# EasyEDA schematic SCH_keyboard_ProMicro_2025-01-13.json

## Sheets
1 Sheet_1: TITLE: Sheet_1; REV: 1.0; Date: 2024-12-30; Sheet: 1/1; Drawn By: polpoillopi; Company: Your Company
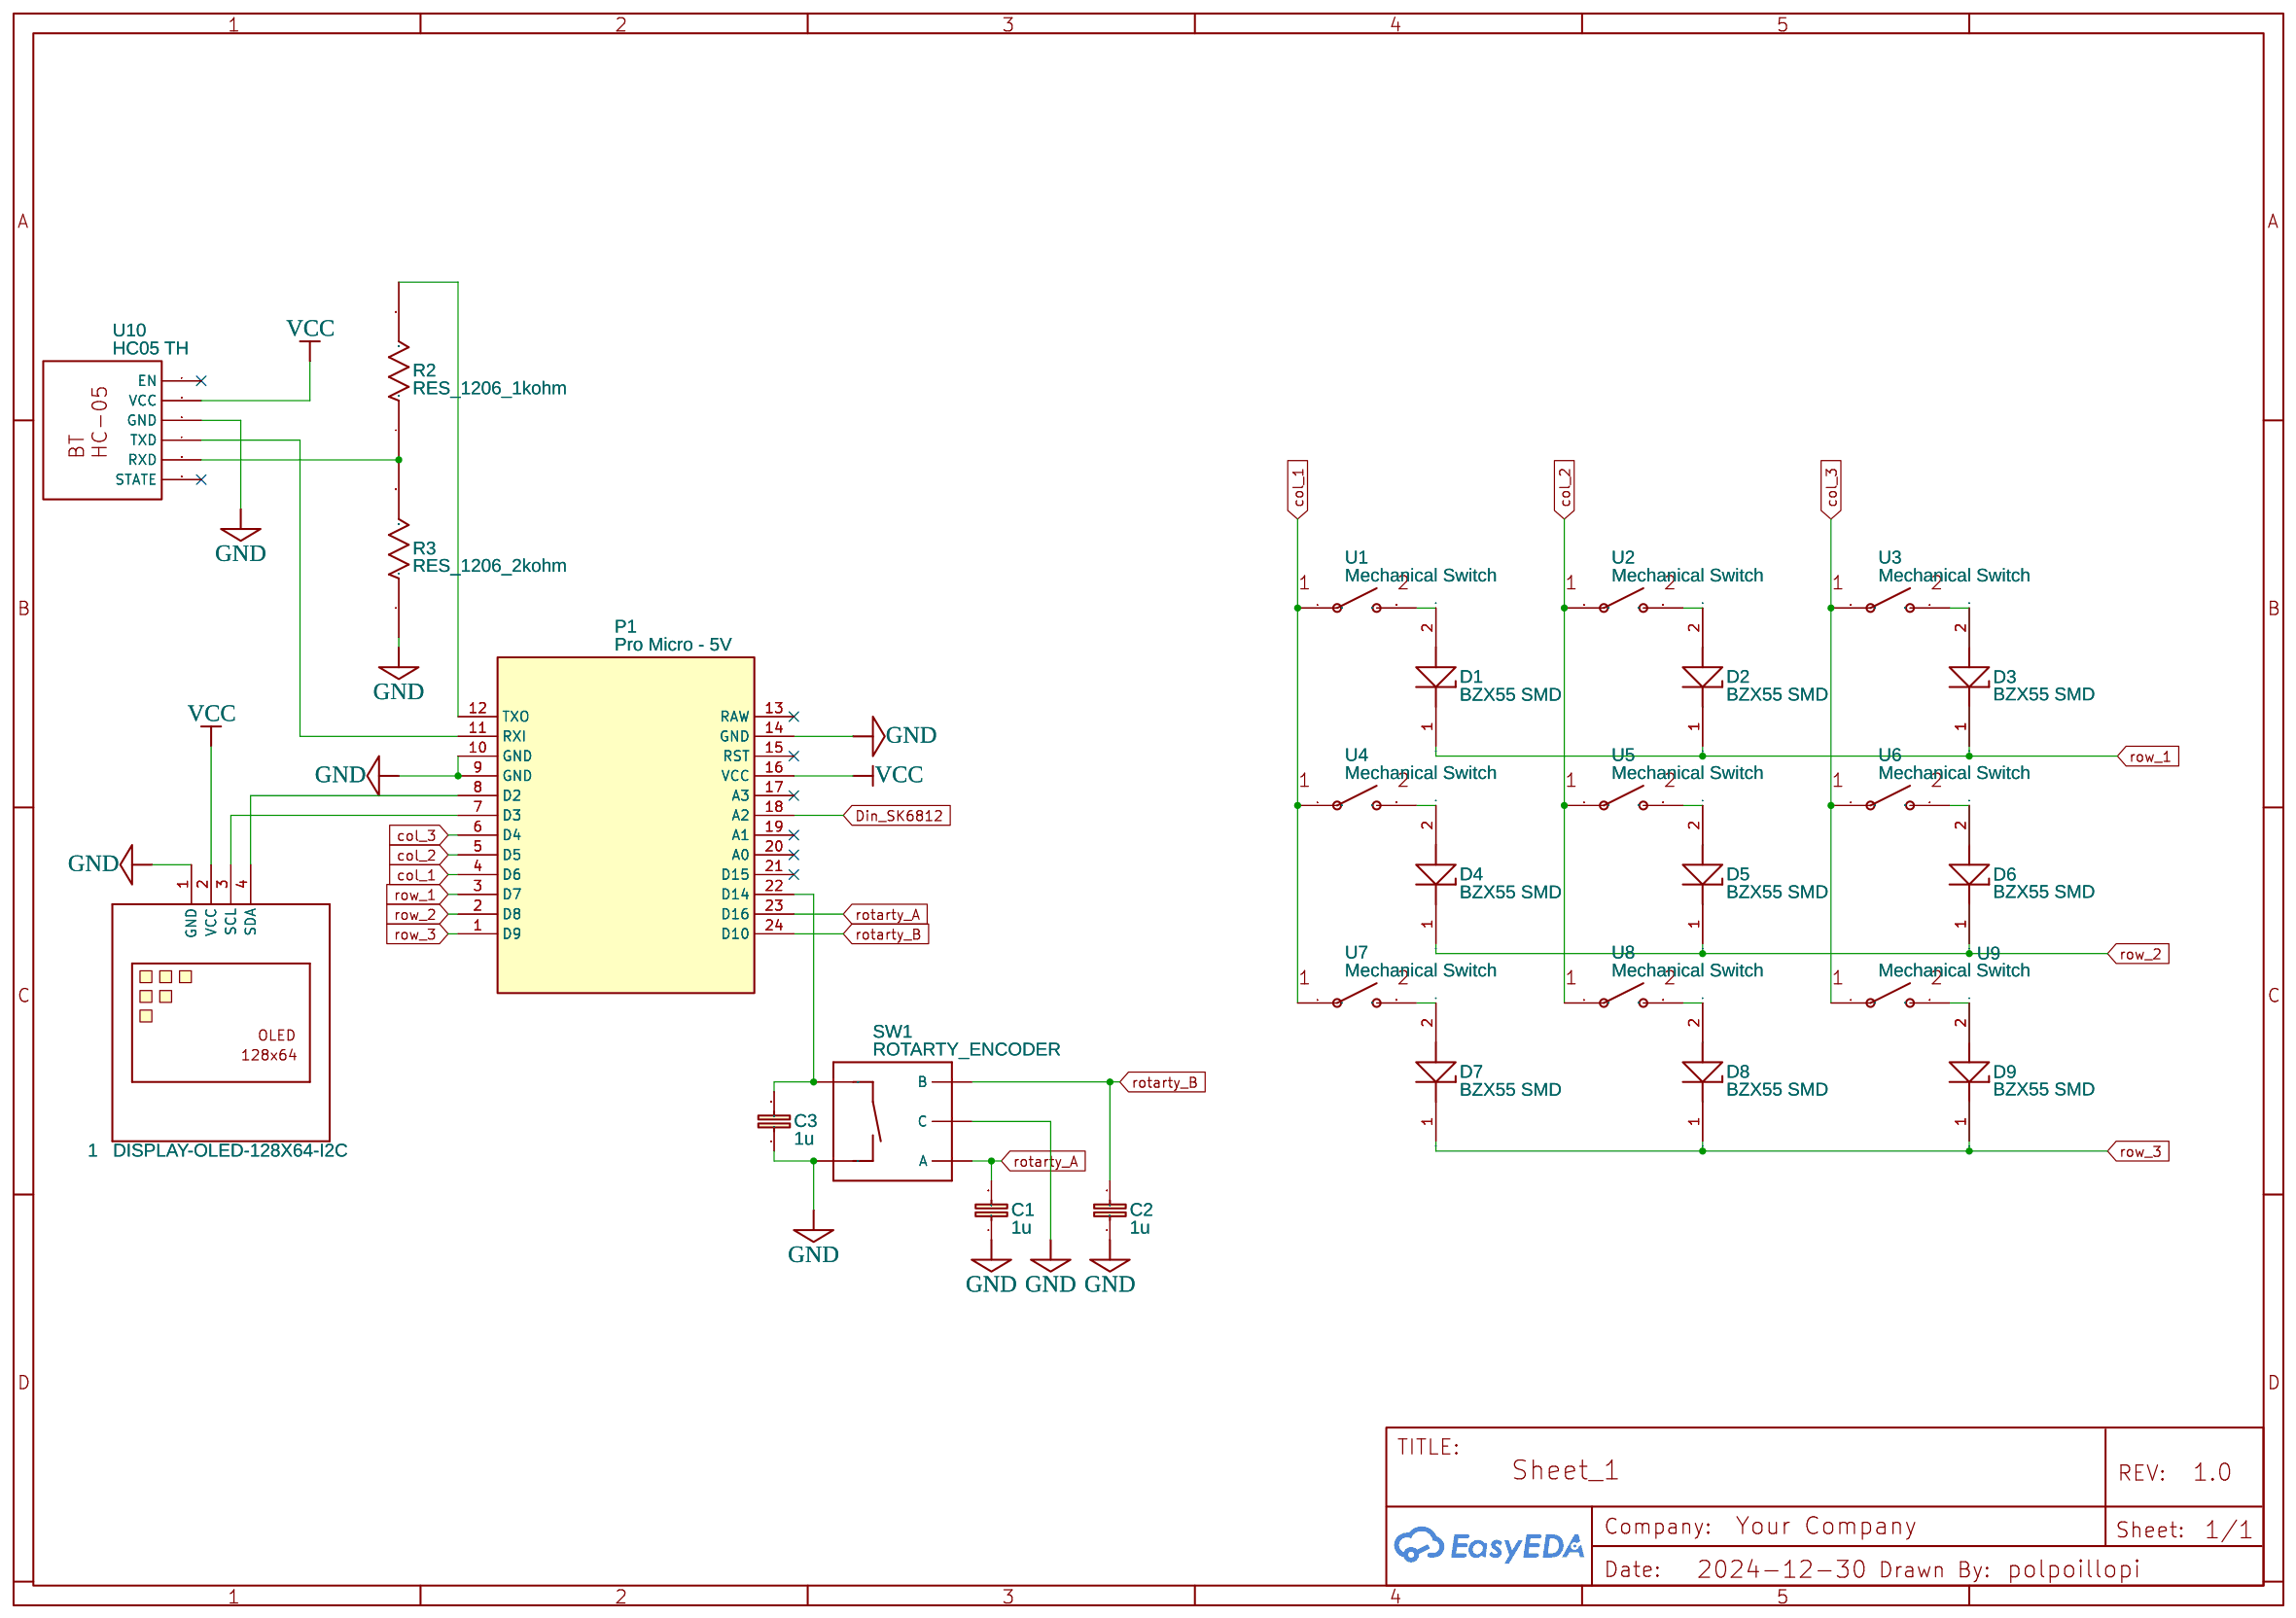
[diagram p0: Sheet_1]
2 Sheet_2: TITLE: Sheet_2; Date: 2025-01-05
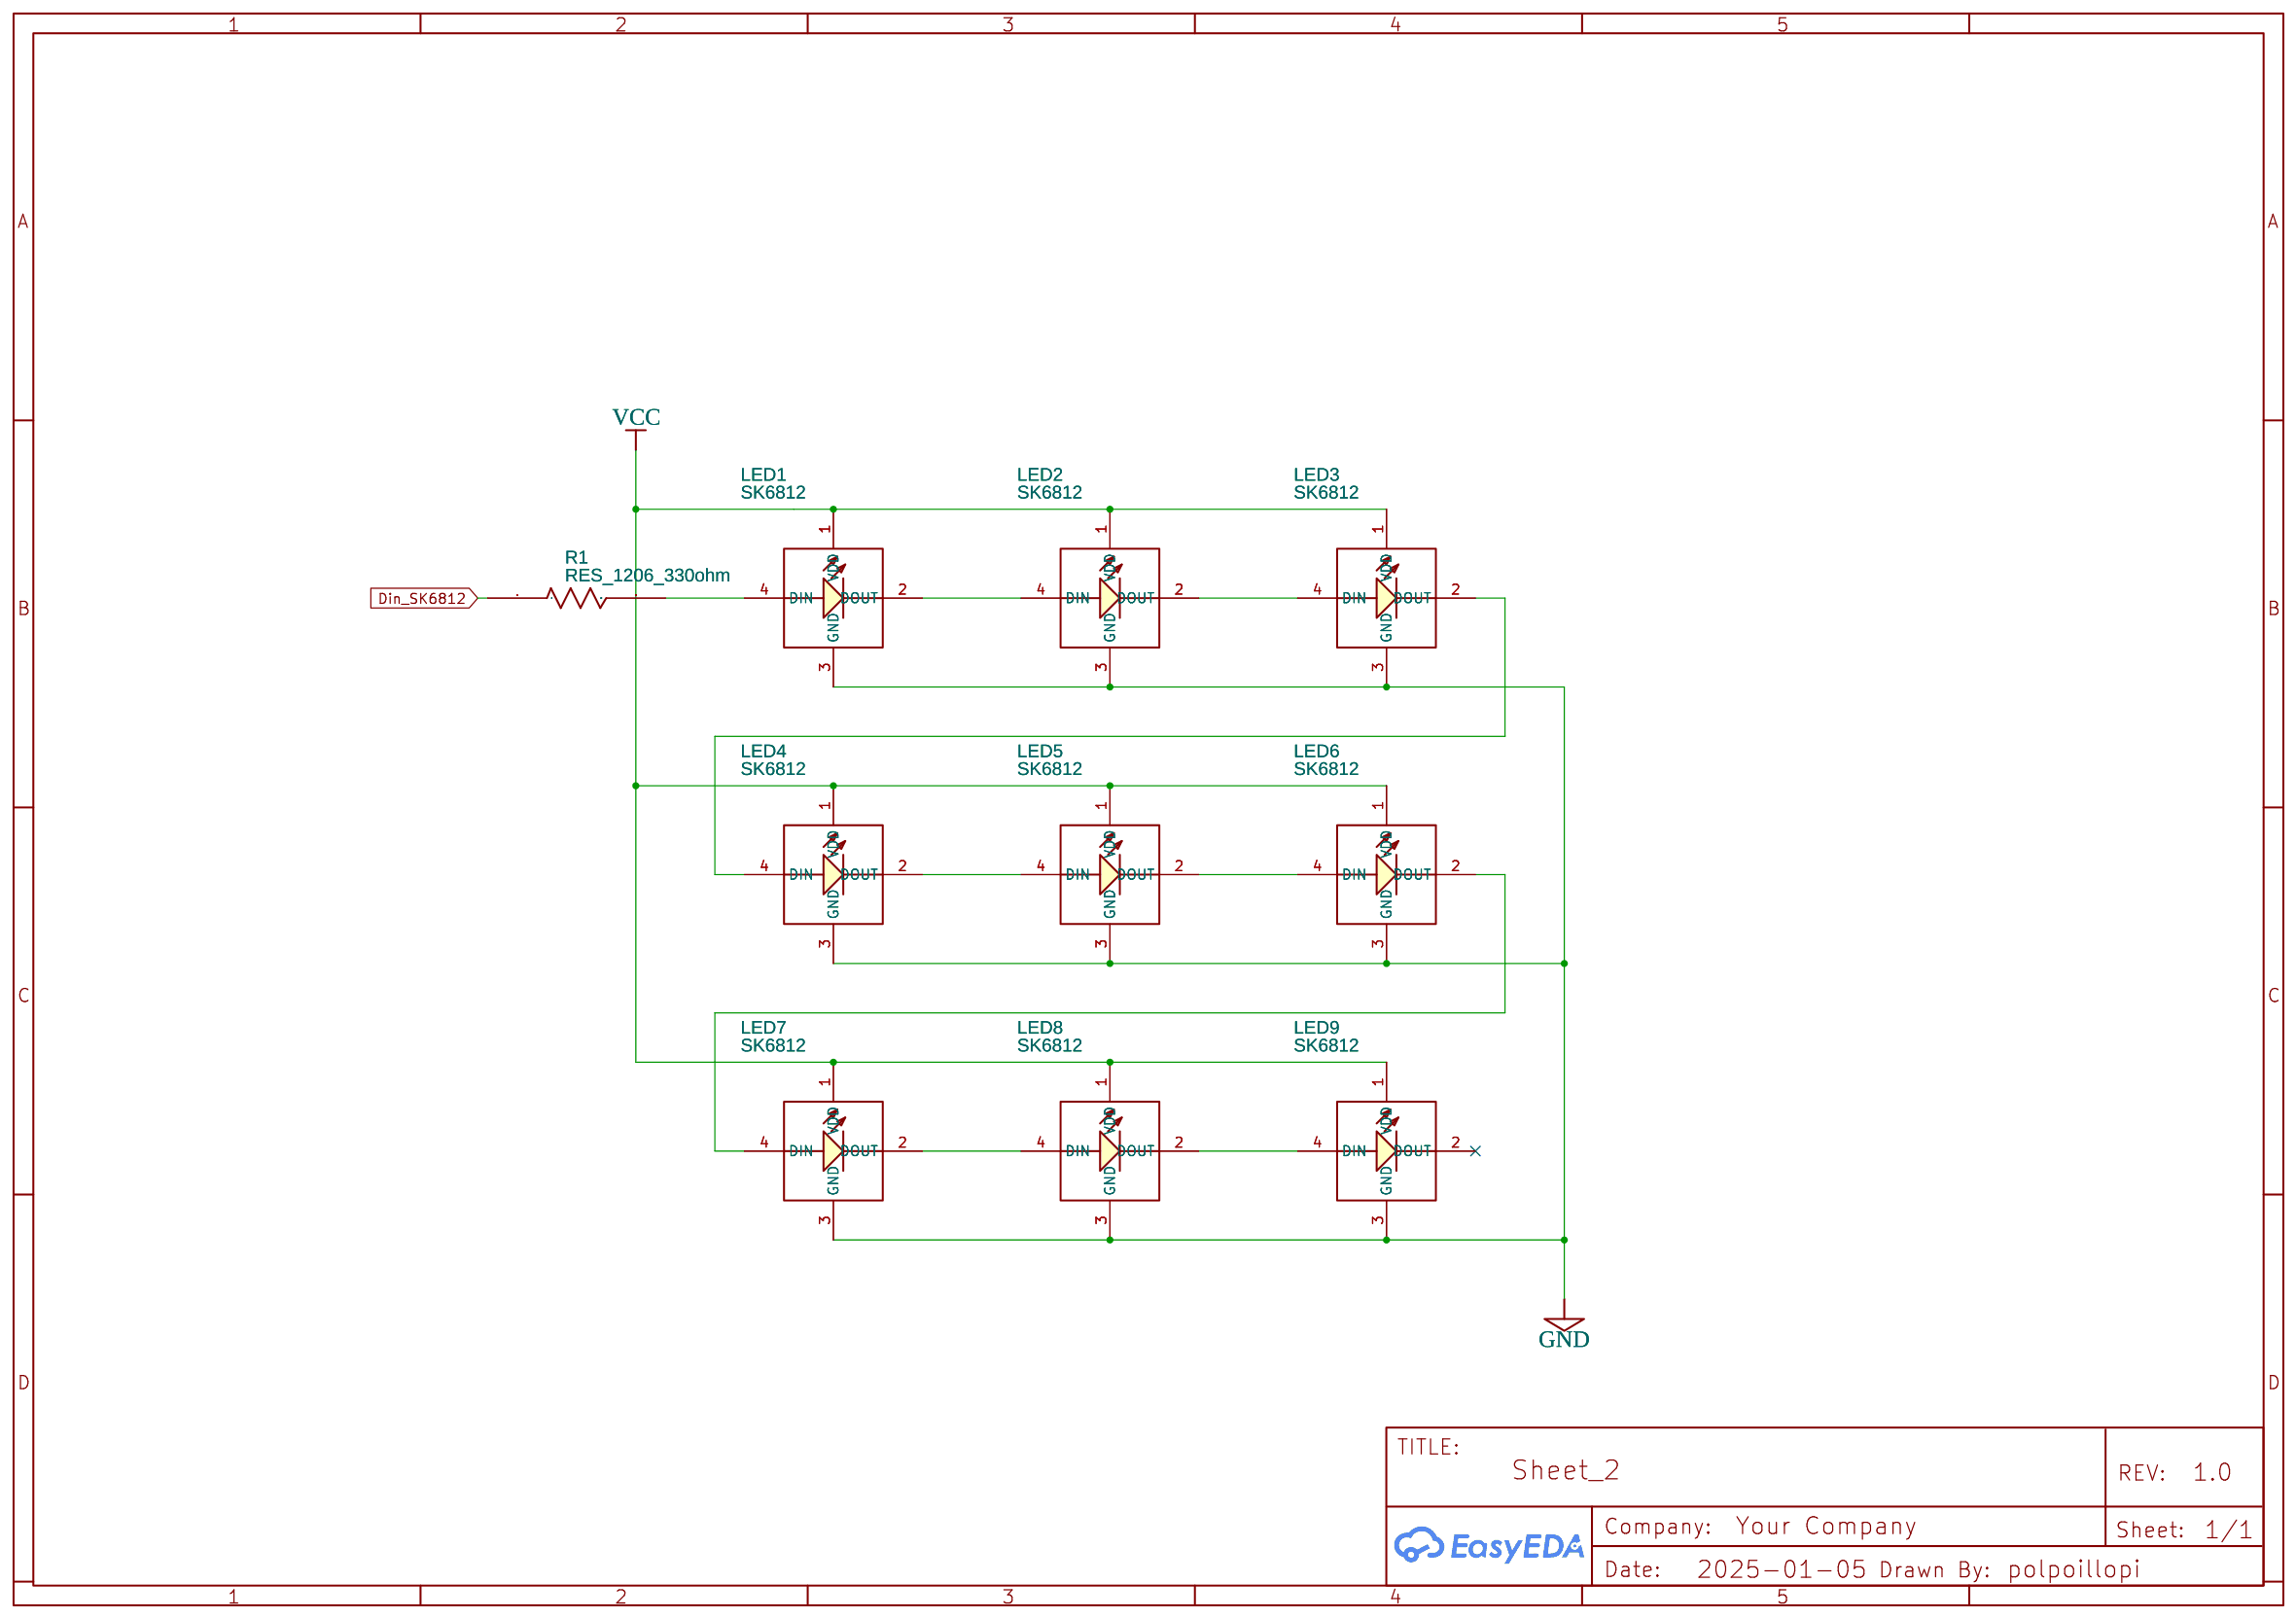
[diagram p1: Sheet_2]

## Parts
sheet Sheet_1
1  DISPLAY-OLED-128X64-I2C  [DISPLAY-OLED-128X64-I2C]
C1  1u  [1206]
C2  1u  [1206]
C3  1u  [1206]
D1  BZX55 SMD  [LL4148]
D2  BZX55 SMD  [LL4148]
D3  BZX55 SMD  [LL4148]
D4  BZX55 SMD  [LL4148]
D5  BZX55 SMD  [LL4148]
D6  BZX55 SMD  [LL4148]
D7  BZX55 SMD  [LL4148]
D8  BZX55 SMD  [LL4148]
D9  BZX55 SMD  [LL4148]
P1  Pro Micro - 5V  [PRO_MICRO_AND_BOTTOMLAYER]
R2  RES_1206_1kohm  [RC1206_RES1206(PRIMARY)]
R3  RES_1206_2kohm  [RC1206_RES1206(PRIMARY)]
SW1  ROTARTY_ENCODER  [ROTARY_ENCODER]
U1  Mechanical Switch  [CHERRY MX KEYSWITCH]
U2  Mechanical Switch  [CHERRY MX KEYSWITCH]
U3  Mechanical Switch  [CHERRY MX KEYSWITCH]
U4  Mechanical Switch  [CHERRY MX KEYSWITCH]
U5  Mechanical Switch  [CHERRY MX KEYSWITCH]
U6  Mechanical Switch  [CHERRY MX KEYSWITCH]
U7  Mechanical Switch  [CHERRY MX KEYSWITCH]
U8  Mechanical Switch  [CHERRY MX KEYSWITCH]
U9  Mechanical Switch  [CHERRY MX KEYSWITCH]
U10  HC05 TH  [HC05 TH]
sheet Sheet_2
LED1  SK6812  [SK6812]
LED2  SK6812  [SK6812]
LED3  SK6812  [SK6812]
LED4  SK6812  [SK6812]
LED5  SK6812  [SK6812]
LED6  SK6812  [SK6812]
LED7  SK6812  [SK6812]
LED8  SK6812  [SK6812]
LED9  SK6812  [SK6812]
R1  RES_1206_330ohm  [RC1206_RES1206(PRIMARY)]

## Library data of the parts
1 = DISPLAY-OLED-128X64-I2C: Contributor: guzez28
C1-C3 = CAP1206: Capacitor; Contributor: SparkFun
D1-D9 = BZX55 SMD: Contributor: kubik88
P1 = Pro Micro - 5V: sourceId: 1T5FDZYC8
R1-R3 = RES_1206_330K_5%: Alt. 1 Manufacturer / Part Number: Same package, power rating, tolerance, and value; Part Number: ERJ-8GEYJ334V; Manufacturer: Panasonic; HelpURL: P:\Altium\Datasheets\RES_THICK_FILM_ERJ.pdf; Supplier 1: Digi-Key; Supplier 2: Digi-Key; Supplier Part Number 1: P330KECT-ND; Supplier Part Number 2: P330KETR-ND; Blendtec Part Number: 15-120-3303EB; Comment: 330K; Contributor: calboy20
SW1 = ROTARTY_ENCODER: Simple no LED rotary encoder; Contributor: SparkFun; Package Display: No
U1 U2 U4-U9 = Cherry MX Mechanical Keyboard Switch: Contributor: Enkhbold Ganbold
U3 = Cherry MX Mechanical Keyboard Switch: Contributor: mohammed123jehad7
U10 = HC05 TH: Contributor: hdutton
LED1-LED9 = SK6812: Supplier Part: 1655; Supplier: AdaFruit; link: https://www.aliexpress.com/item/4000475685852.html?spm=a2g0s.12269583.0.0.572c1e9ceHD99V; Contributor: Edje11

## Nets
GND: 1.1(GND) C1.1 C2.1 C3.1 LED1.3(GND) LED2.3(GND) LED3.3(GND) LED4.3(GND) LED5.3(GND) LED6.3(GND) LED7.3(GND) LED8.3(GND) LED9.3(GND) P1.9(GND) P1.10(GND) P1.14(GND) R3.A SW1.2(C) SW1.5(SW-) U10.3(GND)
VCC: 1.2(VCC) LED1.1(VDD) LED2.1(VDD) LED3.1(VDD) LED4.1(VDD) LED5.1(VDD) LED6.1(VDD) LED7.1(VDD) LED8.1(VDD) LED9.1(VDD) P1.16(VCC) U10.2(VCC)
col_1: P1.4(D6) U1.1 U4.1 U7.1
col_2: P1.5(D5) U2.1 U5.1 U8.1
col_3: P1.6(D4) U3.1 U6.1 U9.1
Din_SK6812: P1.18(A2) R1.A
rotarty_A: C1.2 P1.23(D16) SW1.1(A)
rotarty_B: C2.2 P1.24(D10) SW1.3(B)
row_1: D1.1(A) D2.1(A) D3.1(A) P1.3(D7)
row_2: D4.1(A) D5.1(A) D6.1(A) P1.2(D8)
row_3: D7.1(A) D8.1(A) D9.1(A) P1.1(D9)
Net-(1-3): 1.3(SCL) P1.7(D3)
Net-(1-4): 1.4(SDA) P1.8(D2)
Net-(C3-2): C3.2 P1.22(D14) SW1.4(SW+)
Net-(D1-2): D1.2(K) U1.2
Net-(D2-2): D2.2(K) U2.2
Net-(D3-2): D3.2(K) U3.2
Net-(D4-2): D4.2(K) U4.2
Net-(D5-2): D5.2(K) U5.2
Net-(D6-2): D6.2(K) U6.2
Net-(D7-2): D7.2(K) U7.2
Net-(D8-2): D8.2(K) U8.2
Net-(D9-2): D9.2(K) U9.2
Net-(LED1-2): LED1.2(DOUT) LED2.4(DIN)
Net-(LED1-4): LED1.4(DIN) R1.B
Net-(LED2-2): LED2.2(DOUT) LED3.4(DIN)
Net-(LED3-2): LED3.2(DOUT) LED4.4(DIN)
Net-(LED4-2): LED4.2(DOUT) LED5.4(DIN)
Net-(LED5-2): LED5.2(DOUT) LED6.4(DIN)
Net-(LED6-2): LED6.2(DOUT) LED7.4(DIN)
Net-(LED7-2): LED7.2(DOUT) LED8.4(DIN)
Net-(LED8-2): LED8.2(DOUT) LED9.4(DIN)
Net-(P1-11): P1.11(RXI) U10.4(TXD)
Net-(P1-12): P1.12(TXO) R2.B
Net-(R2-A): R2.A R3.B U10.5(RXD)

Not connected (* = marked no-connect by the designer): LED9 2(DOUT)*; P1 13(RAW)* 15(RST)* 17(A3)* 19(A1)* 20(A0)* 21(D15)*; U10 1(EN)* 6(STATE)*
